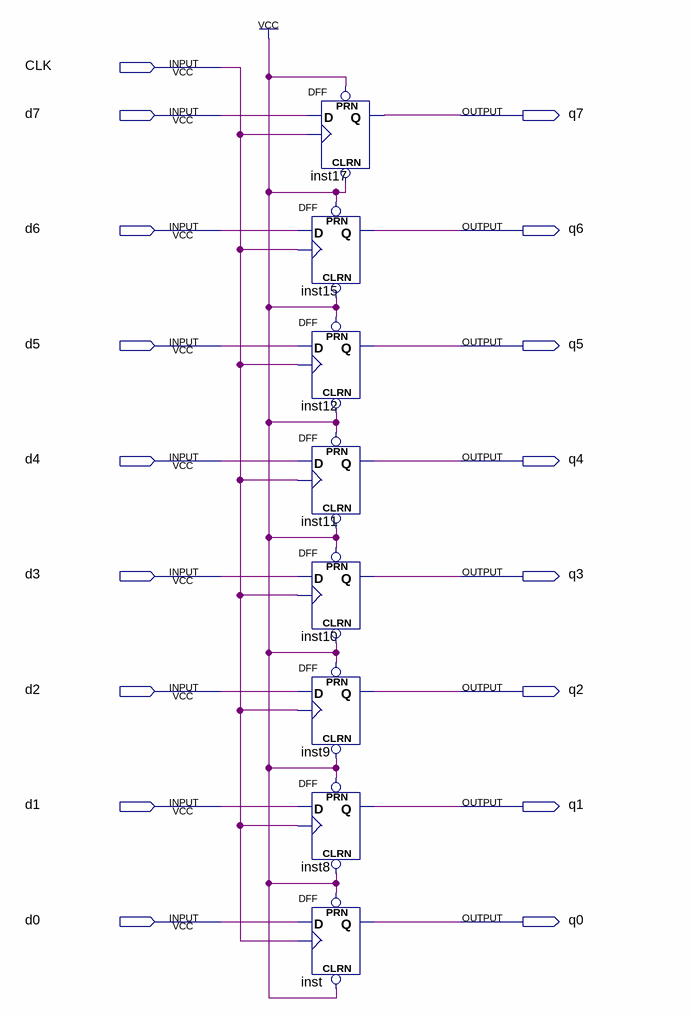
[diagram p0: schematic sheet]
// Quartus schematic R.bdf as structural Verilog: 8 symbols, 17 pins
module R (
  input  CLK,
  input  d7,
  input  d6,
  input  d5,
  input  d4,
  input  d3,
  input  d2,
  input  d1,
  input  d0,
  output q7,
  output q6,
  output q5,
  output q4,
  output q3,
  output q2,
  output q1,
  output q0
);

  DFF inst17 (.CLRN(1'b1), .CLK(CLK), .D(d7), .PRN(1'b1), .Q(q7));
  DFF inst15 (.CLRN(1'b1), .CLK(CLK), .D(d6), .PRN(1'b1), .Q(q6));
  DFF inst12 (.CLRN(1'b1), .CLK(CLK), .D(d5), .PRN(1'b1), .Q(q5));
  DFF inst11 (.CLRN(1'b1), .CLK(CLK), .D(d4), .PRN(1'b1), .Q(q4));
  DFF inst10 (.CLRN(1'b1), .CLK(CLK), .D(d3), .PRN(1'b1), .Q(q3));
  DFF inst9 (.CLRN(1'b1), .CLK(CLK), .D(d2), .PRN(1'b1), .Q(q2));
  DFF inst8 (.CLRN(1'b1), .CLK(CLK), .D(d1), .PRN(1'b1), .Q(q1));
  DFF inst (.CLRN(1'b1), .CLK(CLK), .D(d0), .PRN(1'b1), .Q(q0));
endmodule
